# Altium schematic sheet [01]Power & GPIO Connector.SchDoc
size A
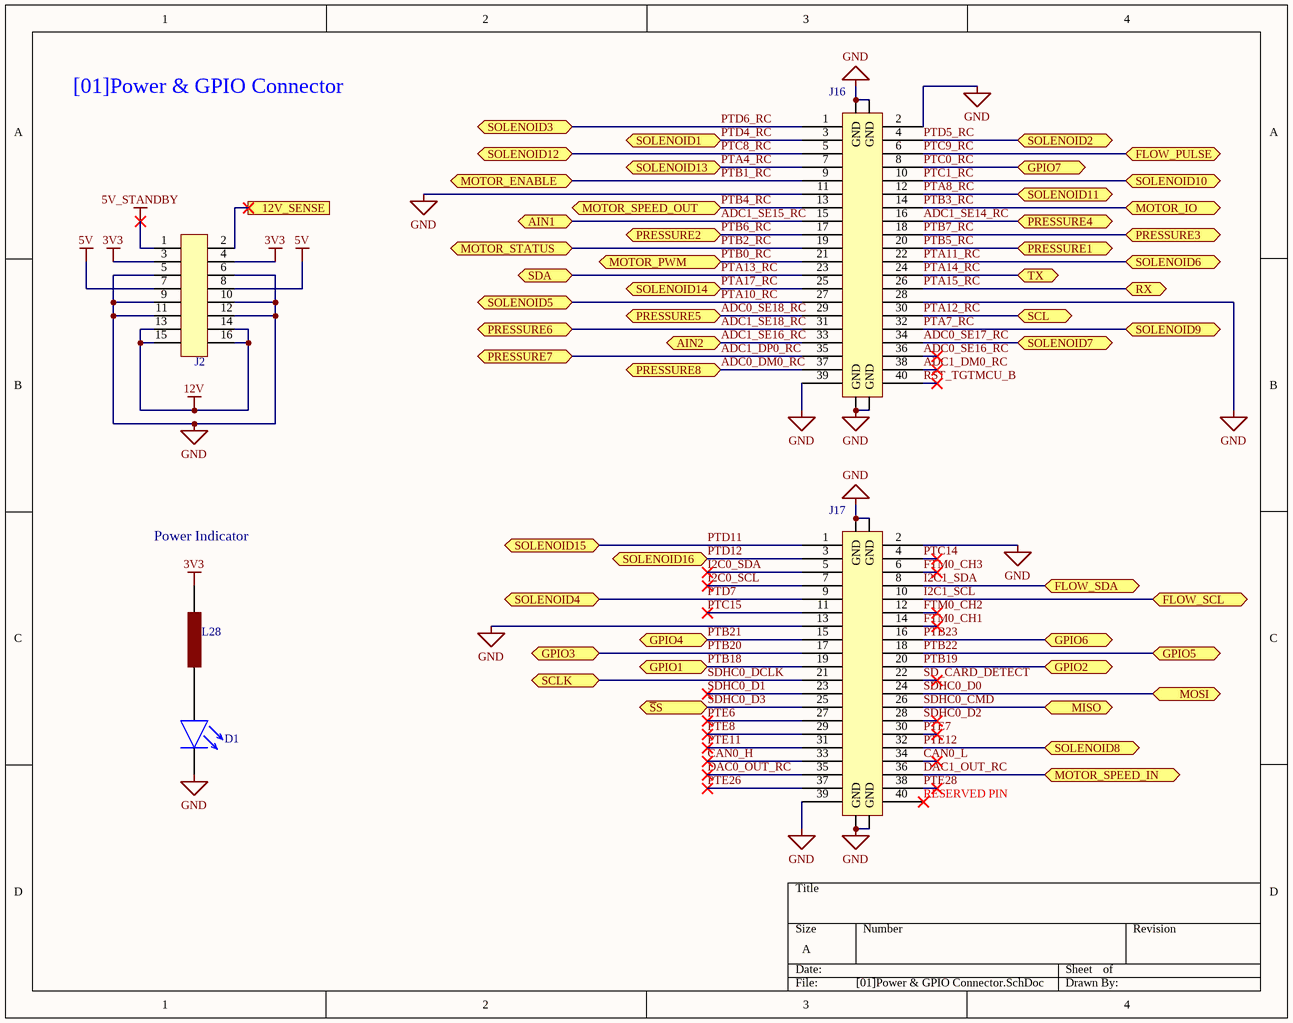
[diagram p0: [01]Power & GPIO Connector.SchDoc]

## Parts
D1  XZFBB45S-9  [PLCC-2]  (value not drawn)
J2  DF11-16DP-2DSA(01)  [DF11-16DP-2DSA(01)_FLIP]  (value not drawn)
J16  M55-7004042R  [M55-7004042R_FLIP]  (value not drawn)
J17  M55-7004042R  [M55-7004042R_FLIP]  (value not drawn)
L28  MH2029-300Y  [INDC2012X11N]  (value not drawn)

## Ports
12V_SENSE, AIN1 (bidir), AIN2 (bidir), FLOW_PULSE (bidir), FLOW_SCL (bidir), FLOW_SDA (bidir), GPIO1 (bidir), GPIO2 (bidir), GPIO3 (bidir), GPIO4 (bidir), GPIO5 (bidir), GPIO6 (bidir), GPIO7 (bidir), MISO (bidir), MOSI (bidir), MOTOR_ENABLE (bidir), MOTOR_IO (bidir), MOTOR_PWM (bidir), MOTOR_SPEED_IN (bidir), MOTOR_SPEED_OUT (bidir), MOTOR_STATUS (bidir), PRESSURE1 (bidir), PRESSURE2 (bidir), PRESSURE3 (bidir), PRESSURE4 (bidir), PRESSURE5 (bidir), PRESSURE6 (bidir), PRESSURE7 (bidir), PRESSURE8 (bidir), RX (bidir), SCL (bidir), SCLK (bidir), SDA (bidir), SOLENOID1 (bidir), SOLENOID2 (bidir), SOLENOID3 (bidir), SOLENOID4 (bidir), SOLENOID5 (bidir), SOLENOID6 (bidir), SOLENOID7 (bidir), SOLENOID8 (bidir), SOLENOID9 (bidir), SOLENOID10 (bidir), SOLENOID11 (bidir), SOLENOID12 (bidir), SOLENOID13 (bidir), SOLENOID14 (bidir), SOLENOID15 (bidir), SOLENOID16 (bidir), TX (bidir), ~{S}S (bidir)

## Nets
3V3: J2.3 J2.4 L28.2
5V: J2.7 J2.8
5V_STANDBY: J2.1
12V: J2.13 J2.14 J2.15 J2.16
GND: D1.2 J2.5 J2.6 J2.9 J2.10 J2.11 J2.12 J16.2 J16.11 J16.28 J16.39 J16.GND J17.2 J17.13 J17.39 J17.GND
12V_SENSE: J2.2 ; port 12V_SENSE
ADC0_DM0_RC: J16.37 ; port PRESSURE8
ADC0_SE16_RC: J16.36
ADC0_SE17_RC: J16.34 ; port SOLENOID7
ADC0_SE18_RC: J16.29 ; port PRESSURE5
ADC1_DM0_RC: J16.38
ADC1_DP0_RC: J16.35 ; port PRESSURE7
ADC1_SE14_RC: J16.16 ; port PRESSURE4
ADC1_SE15_RC: J16.15 ; port AIN1
ADC1_SE16_RC: J16.33 ; port AIN2
ADC1_SE18_RC: J16.31 ; port PRESSURE6
CAN0_H: J17.33
CAN0_L: J17.34
DAC0_OUT_RC: J17.35
DAC1_OUT_RC: J17.36 ; port MOTOR_SPEED_IN
FTM0_CH1: J17.14
FTM0_CH2: J17.12
FTM0_CH3: J17.6
I2C0_SCL: J17.7
I2C0_SDA: J17.5
I2C1_SCL: J17.10 ; port FLOW_SCL
I2C1_SDA: J17.8 ; port FLOW_SDA
PTA4_RC: J16.7 ; port SOLENOID13
PTA7_RC: J16.32 ; port SOLENOID9
PTA8_RC: J16.12 ; port SOLENOID11
PTA10_RC: J16.27 ; port SOLENOID5
PTA11_RC: J16.22 ; port SOLENOID6
PTA12_RC: J16.30 ; port SCL
PTA13_RC: J16.23 ; port SDA
PTA14_RC: J16.24 ; port TX
PTA15_RC: J16.26 ; port RX
PTA17_RC: J16.25 ; port SOLENOID14
PTB0_RC: J16.21 ; port MOTOR_PWM
PTB1_RC: J16.9 ; port MOTOR_ENABLE
PTB2_RC: J16.19 ; port MOTOR_STATUS
PTB3_RC: J16.14 ; port MOTOR_IO
PTB4_RC: J16.13 ; port MOTOR_SPEED_OUT
PTB5_RC: J16.20 ; port PRESSURE1
PTB6_RC: J16.17 ; port PRESSURE2
PTB7_RC: J16.18 ; port PRESSURE3
PTB18: J17.19 ; port GPIO1
PTB19: J17.20 ; port GPIO2
PTB20: J17.17 ; port GPIO3
PTB21: J17.15 ; port GPIO4
PTB22: J17.18 ; port GPIO5
PTB23: J17.16 ; port GPIO6
PTC0_RC: J16.8 ; port GPIO7
PTC1_RC: J16.10 ; port SOLENOID10
PTC8_RC: J16.5 ; port SOLENOID12
PTC9_RC: J16.6 ; port FLOW_PULSE
PTC14: J17.4
PTC15: J17.11
PTD4_RC: J16.3 ; port SOLENOID1
PTD5_RC: J16.4 ; port SOLENOID2
PTD6_RC: J16.1 ; port SOLENOID3
PTD7: J17.9 ; port SOLENOID4
PTD11: J17.1 ; port SOLENOID15
PTD12: J17.3 ; port SOLENOID16
PTE6: J17.27
PTE7: J17.30
PTE8: J17.29
PTE11: J17.31
PTE12: J17.32 ; port SOLENOID8
PTE26: J17.37
PTE28: J17.38
RST_TGTMCU_B: J16.40
SD_CARD_DETECT: J17.22
SDHC0_CMD: J17.26 ; port MISO
SDHC0_D0: J17.24 ; port MOSI
SDHC0_D1: J17.23
SDHC0_D2: J17.28
SDHC0_D3: J17.25 ; port ~{S}S
SDHC0_DCLK: J17.21 ; port SCLK
NetD1_1: D1.1 L28.1

Not connected (* = marked no-connect by the designer): J17 40*

## Notes on the sheet
- [01]Power & GPIO Connector
- Power Indicator
- (near J17) RESERVED PIN

## Library data of the parts
D1 = XZFBB45S-9: LED BLUE CLEAR 2PLCC SMD; Manufacturer: SunLED; Configuration: Standard; Lens Color: Colorless; Millicandela Rating: 447mcd; Lens Style: Round with Flat Top; Lens Size: 2.40mm Dia; Voltage - Forward (Vf) (Typ): 3.3V; Current - Test: 20mA; Viewing Angle: 120°; Wavelength - Dominant: 470nm; Wavelength - Peak: 465nm; Supplier 1: Digi-Key; Manufacturer Part Number: XZFBB45S-9; RoHS: RoHS Compliant; Category: Optoelectronics; Stock 1: 5275; Pricing 1: 1=0.83, 10=0.651, 25=0.5456, 100=0.4752, 250=0.4224, 500=0.3696, 1000=0.2992 (USD); Packaging: Cut Tape (CT); Part Status: Active; Color: Blue; Lens Transparency: Clear; Mounting Type: Surface Mount, Bottom Entry; Features: -; Package / Case: 2-SMD, Z-Bend; Supplier Device Package: 2-PLCC; Size / Dimension: 3.20mm L x 2.80mm W; Height (Max): 1.90mm; ComponentLink1URL: http://www.sunledusa.com/products/spec/XZFBB45S-9.pdf; ComponentLink1Description: http://www.sunledusa.com/products/spec/XZFBB45S-9.pdf; Supplier Part Number 1: 1497-1233-1-ND
J2 = DF11-16DP-2DSA(01): Headers & Wire Housings 2MM V PCB HEADER 16P DR THRU-HOLE GLD; Manufacturer: Hirose Connector; Current Rating: 2 A; Mounting Angle: Vertical; Number of Positions: 16 Position; Voltage Rating: 250 V; Supplier 1: Digi-Key; Manufacturer Part Number: DF11-16DP-2DSA(01); RoHS: RoHS Compliant; Category: Headers & Wire Housings; Contact Plating: Gold; Number of Rows: 2 Row; Packaging: Bulk; Product: Headers; Series: DF11; Termination Style: Through Hole; Type: Shrouded; Brand: Hirose Connector; Contact Material: Brass; Mounting Style: -; Pitch: 2 mm; Standard Pack Qty: 100; RoHS - Mouser: Y; Minimum Order Quantity: 1; Reeling: False; ComponentLink1URL: http://www.mouser.com/datasheet/2/185/DF11_catalog-939040.pdf; ComponentLink1Description: http://www.mouser.com/datasheet/2/185/DF11_catalog-939040.pdf; Supplier Part Number 1: H2856-ND
J16 J17 = M55-7004042R: Board to Board & Mezzanine Connectors 40P 1.27 SMC Male; Manufacturer: Harwin; Current Rating: 1.2 A; Mounting Angle: Straight; Number of Positions: 40 Position; Voltage Rating: 100 V; Pitch: 1.27 mm; Insulation Resistance: 10 GOhms; Stack Height: 6.75 mm; Product Status: New Product; Supplier 1: Digi-Key; Manufacturer Part Number: M55-7004042R; RoHS: RoHS Compliant; Category: Board to Board & Mezzanine Connectors; Contact Plating: Gold; Housing Material: Liquid Crystal Polymer (LCP); Number of Rows: 2 Row; Packaging: Cut Tape; Product: Headers; Termination Style: SMD/SMT; Brand: Harwin; Contact Material: Phosphor Bronze; Flammability Rating: UL 94 V-0; Mounting Style: Mounting Peg; Maximum Operating Temperature: + 125 C; Minimum Operating Temperature: - 55 C; Standard Pack Qty: 500; Termination Post Length: 4 mm; Tradename: Archer Kontrol; RoHS - Mouser: Y; Minimum Order Quantity: 1; Reeling: True; ComponentLink1URL: http://www.mouser.com/datasheet/2/181/M55-70X-1286676.pdf; ComponentLink1Description: http://www.mouser.com/datasheet/2/181/M55-70X-1286676.pdf; Supplier Part Number 1: 952-3871-1-ND
L28 = MH2029-300Y: EMI Filter Beads, Chips & Arrays Impedance 30ohms IDC 3.0; Manufacturer: Bourns; Maximum DC Current: 3 A; Maximum DC Resistance: 25 mOhms; Tolerance: 25 %; Type: High Current Chip Ferrite Bead; Test Frequency: 100 MHz; Filter Type: Power, Signal Line; Number of Lines: 1; Impedance @ Frequency: 30 Ohm @ 100MHz; Current Rating (Max): 3A; DC Resistance (DCR) (Max): 25 mOhm; Manufacturer Part Number: MH2029-300Y; RoHS: RoHS Compliant; Category: EMI Filter Beads, Chips & Arrays; Pricing 1: 1=0.1, 10=0.062, 25=0.0568, 50=0.051, 100=0.0375, 250=0.02724, 500=0.02498, 1000=0.02157 (USD); Capacitance: -; Height: 0.9 mm; Impedance: 30 Ohms; Length: 2 mm; Operating Temperature Range: - 55 C to + 125 C; Package / Case: 0805 (2012 metric); Packaging: Reel; Product: Ferrite Chip Beads; Termination Style: SMD/SMT; Width: 1.2 mm; Brand: Bourns; Product Category: SMD Ferrite Bead; Standard Pack Qty: 4000; RoHS - Mouser: Y; Minimum Order Quantity: 1; Reeling: True; ComponentLink1URL: http://www.mouser.com/ds/2/54/h-777565.pdf; ComponentLink1Description: http://www.mouser.com/ds/2/54/h-777565.pdf; Supplier 1: Digi-Key; Stock 1: 62738; Ratings: -; Operating Temperature: -55°C ~ 125°C; Mounting Type: Surface Mount; Height (Max): 0.043" (1.10mm); Size / Dimension: 0.079" L x 0.047" W (2.00mm x 1.20mm); ComponentLink2URL: http://www.bourns.com/docs/Product-Datasheets/mh.pdf; ComponentLink2Description: http://www.bourns.com/docs/Product-Datasheets/mh.pdf; Supplier Part Number 1: MH2029-300YCT-ND